# Altium schematic sheet Regulators.SchDoc
size A4
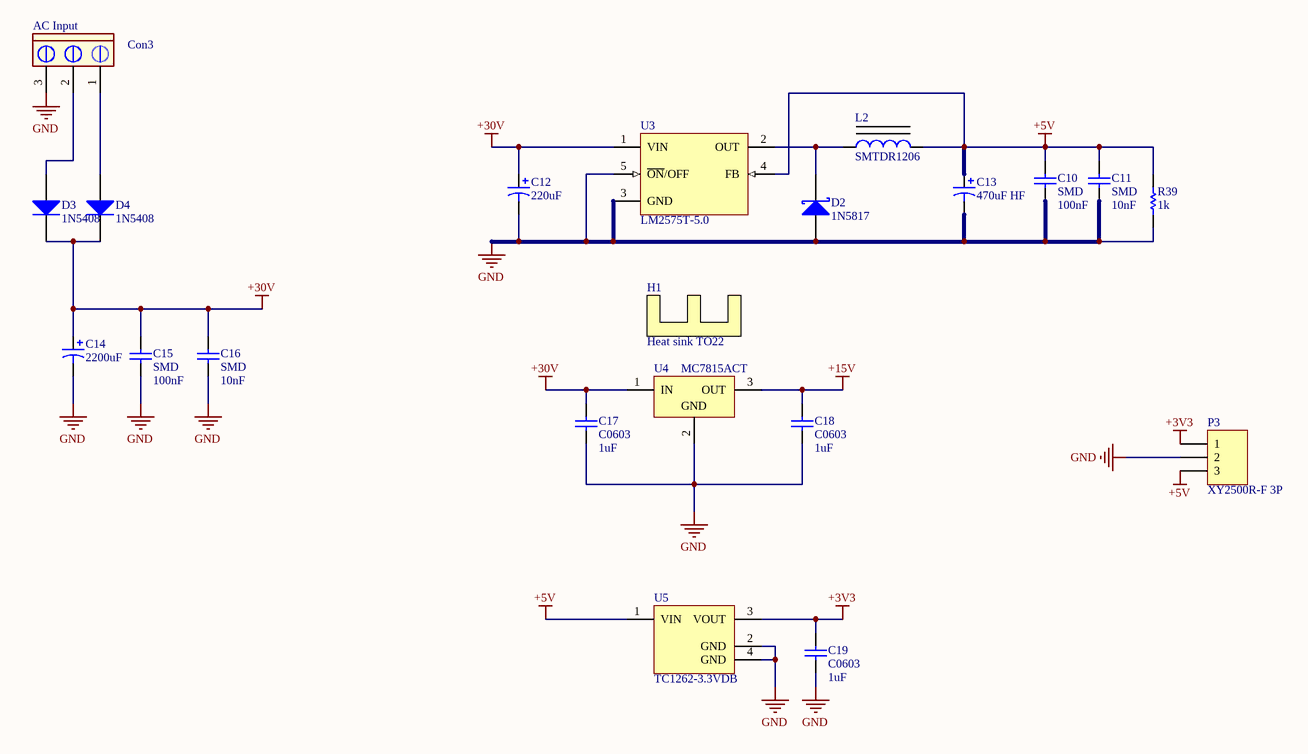
[diagram p0: Regulators.SchDoc]

## Parts
C10  SMD  value 100nF  [1206]
C11  SMD  value 10nF  [1206]
C12  220uF  [CAPPR5-10X16]
C13  470uF HF  [CAPPR5-10X20]
C14  2200uF  [CAPPR7.5-16X35.5]
C15  SMD  value 100nF  [1206]
C16  SMD  value 10nF  [1206]
C17  C0603  value 1uF  [0603]
C18  C0603  value 1uF  [0603]
C19  C0603  value 1uF  [0603]
Con3  AC Input  [My_CN3]
D2  1N5817  [DO-41]
D3  1N5408  [DO-201AD]
D4  1N5408  [DO-201AD]
H1  Heat sink TO22  [My_Heat_sink_TO22]
L2  SMTDR1206  [SMTDR1206 Inductor]
P3  XY2500R-F 3P  [XY2500R-F 3P]
R39  value 1k  [8RB-1206]  (hidden comment: SMD)
U3  LM2575T-5.0  [T05A]
U4  MC7815ACT  [221A-04]
U5  TC1262-3.3VDB  [SOT-223-DB3_N]

## Nets
+3V3: C19.2 P3.1 U5.3(VOUT)
+5V: C10.2 C11.2 C13.1 L2.2 P3.3 R39.2 U3.4(FB) U5.1(VIN)
+15V: C18.2 U4.3(OUT)
+30V: C12.1 C14.1 C15.2 C16.2 C17.2 D3.2(K) D4.2(K) U3.1(VIN) U4.1(IN)
GND: C10.1 C11.1 C12.2 C13.2 C14.2 C15.1 C16.1 C17.1 C18.1 C19.1 Con3.3 D2.1(A) P3.2 R39.1 U3.3(GND) U3.5(~{ON}/OFF) U4.2(GND) U5.2(GND) U5.4(GND)
NetCon3_1: Con3.1 D4.1(A)
NetCon3_2: Con3.2 D3.1(A)
NetD2_2: D2.2(K) L2.1 U3.2(OUT)

## Library data of the parts
C10 C11 C15 C16 = C1206: Ceramic Chip Capacitor - Standard; Published: 17-Jul-2002; LatestRevisionDate: 19-Mar-2004; LatestRevisionNote: Silkscreen size reduced.; DatasheetDocument: Mar-2001; PackageDocument: Mar-2001; PackageReference: 1206; Publisher: Altium Limited; Code_JEITA: 1206; Code_IPC: 3216 [1206]; ComponentLink1Description: Manufacturer Link; ComponentLink1URL: http://www.kemet.com/; ComponentLink2Description: Datasheet; ComponentLink2URL: http://www.kemet.com/kemet/web/homepage/kechome.nsf/vapubfilesname/F3102TA.pdf/$file/F3102TA.pdf
C12 = EKA00DD322J00: Aluminum Electrolytic Capacitor, Radial Style with Long Leads: 220uF, 63V; Note: Refer to Manufacturer's Data Sheets for other lead formations; DrillSize: Nominal, Rounded To The Nearest 0.1mm; Published: 19-Mar-2004; DatasheetDocument: 20-Feb-2001; PackageReference: CAPPR5-10X16; Publisher: Altium Limited; ComponentLink1Description: Manufacturer Link; ComponentLink1URL: http://www.vishay.com/; ComponentLink2Description: Datasheet; ComponentLink2URL: http://www.vishay.com/docs/25014/eka.pdf; Value: 220uF
C13 = EKC00DE347E00: Aluminum Electrolytic Capacitor, Radial Style with Long Leads: 470uF, 25V; Note: Refer to Manufacturer's Data Sheets for other lead formations; DrillSize: Nominal, Rounded To The Nearest 0.1mm; Published: 19-Mar-2004; DatasheetDocument: 12-Jan-2000; PackageReference: CAPPR5-10X20; Publisher: Altium Limited; ComponentLink1Description: Manufacturer Link; ComponentLink1URL: http://www.vishay.com/; ComponentLink2Description: Datasheet; ComponentLink2URL: http://www.vishay.com/docs/25009/ekc.pdf; Value: 470uF
C14 = EKA00JL422H00: Aluminum Electrolytic Capacitor, Radial Style with Long Leads: 2200uF, 50V; Note: Refer to Manufacturer's Data Sheets for other lead formations; DrillSize: Nominal, Rounded To The Nearest 0.1mm; Published: 19-Mar-2004; DatasheetDocument: 20-Feb-2001; PackageReference: CAPPR7.5-16X35.5; Publisher: Altium Limited; ComponentLink1Description: Manufacturer Link; ComponentLink1URL: http://www.vishay.com/; ComponentLink2Description: Datasheet; ComponentLink2URL: http://www.vishay.com/docs/25014/eka.pdf; Value: 2200uF
C17-C19 = C0603: C1608X7R1C105K X7R; Note: Footprint corresponds to dimensions for bulk cassette packaging. This case size has tightened tolerances.; Published: 17-Jul-2002; LatestRevisionDate: 19-Mar-2004; LatestRevisionNote: Silkscreen size reduced.; DatasheetDocument: Mar-2001; PackageDocument: Mar-2001; PackageReference: 0603; Publisher: Altium Limited; Code_JEITA: 0603; Code_IPC: 1608 [0603]; ComponentLink1Description: Manufacturer Link; ComponentLink1URL: http://www.kemet.com/; ComponentLink2Description: Datasheet; ComponentLink2URL: http://www.kemet.com/kemet/web/homepage/kechome.nsf/vapubfilesname/F3102TA.pdf/$file/F3102TA.pdf
Con3 = CON3 pin Green: Connector green screw
D2 = 1N6095: Schottky Rectifier; Note: No PCB Footprint Available; Published: 8-Jun-2000; LatestRevisionDate: 17-Jul-2002; LatestRevisionNote: Re-released for DXP Platform.; DatasheetVersion: Dec-1997; PackageReference: DO-203AA; Publisher: Altium Limited; ComponentLink1Description: Manufacturer Link; ComponentLink1URL: http://www.irf.com/; ComponentLink2Description: Datasheet; ComponentLink2URL: http://www.irf.com/product-info/datasheets/data/1n6096.pdf
D3 D4 = Diode 1N5408: 3 Amp Medium Power Silicon Rectifier Diode; Published: 8-Jun-2000; LatestRevisionDate: 17-Jul-2002; LatestRevisionNote: Re-released for DXP Platform.; DatasheetVersion: Aug-1984; PackageReference: DO-201AD; Publisher: Altium Limited; PackageDescription: Diode, Axial; Body 9.5 x 5.3 mm (LxDia. max), Lead Dia. 1.32 mm (max); ComponentLink1Description: Manufacturer Link; ComponentLink1URL: http://www.irf.com/
H1 = Heat sink TO22: Heat sink for TO22
L2 = 100UHY SMD 18.54X7.11MM 20% 3A 0.19E SMTDR1206-101M: Value: 100uH
P3 = XY2500R-F 3P: HEADER 3P P/CI 90gra VERDE P=3.81MM XY2500R-F
R39 = ERJ8BQ: Low Ohmic Value Thick Film Chip Resistor, 0.22 Ohm to 9.1 Ohm Range, 1%, 2% and 5% Tolerance, 1206 Size, 0.33 W; Published: 17-Dec-2003; LatestRevisionDate: 19-Mar-2004; LatestRevisionNote: Silkscreen size reduced.; PackageDocument: Mar-2003; PackageReference: 8RB-1206; Publisher: Altium Limited; Code_IPC: 3216 [1206]; ComponentLink1Description: Manufacturer Link; ComponentLink1URL: http://www.panasonic.com/industrial/components/resistive_products.htm; ComponentLink2Description: Datasheet; ComponentLink2URL: http://www.panasonic.com/industrial/components/pdf/AOA0000CE3.pdf
U3 = LM2575T-5.0: SIMPLE SWITCHER® 1A Step-Down Voltage Regulator, 5-pin TO-220; Manufacturer: National Semiconductor; PackageTopMarking: NSUZXYTTE#*LM2575T*-5.0 P+; PowerWise: N; Published: 4-Dec-2008; DatasheetVersion: Apr-2007; PackageVersion: revJ, Jan-1992; PackageReference: T05A; Publisher: Altium Limited; PackageDescription: TO-220, Molded, 5 Lead, Straight; Supplier 1: Farnell; Supplier Part Number 1: 1523839; Supplier 2: Farnell; Supplier Part Number 2: 9488090; PartNumber: LM2575T-5.0; RoHS: N; PinCount: 5; CompType: Switcher; Code_JEDEC: TO-220-AB; ComponentLink1Description: LM2575 Datasheet; ComponentLink1URL: http://www.national.com/ds/LM/LM2575.pdf; ComponentLink2Description: LM2575 Web Page; ComponentLink2URL: http://www.national.com/pf/LM/LM2575.html; ComponentLink3Description: T05A Package Page; ComponentLink3URL: http://www.national.com/packaging/folders/t05a.html
U4 = MC7815ACT: 3-Terminal Positive Fixed Voltage Regulator; Note: Pin 2 is electrically connected to TAB; Published: 17-Jul-2002; DatasheetVersion: 1988; PackageReference: 221A-04; Publisher: Altium Limited; PackageDescription: TO, Thru-Hole, Vertical, Heatsink Mounted; 3 In-Line Leads; Pitch 2.54 mm; Code_JEDEC: TO-262-AA; ComponentLink1Description: Manufacturer Link; ComponentLink1URL: http://www.onsemi.com/site/products/taxonomy/0,4438,503,00.html; ComponentLink2Description: Datasheet; ComponentLink2URL: http://www.onsemi.com/pub/Collateral/MC7800-D.PDF
U5 = TC1262-3.3VDB: 500mA Fixed Output CMOS LDO, 3-Pin SOT-223, Extended Temperature; Published: 29-Jan-2009; DatasheetVersion: revB, 2002; PackageVersion: revBB, Aug-2009; PackageReference: SOT-223-DB3; Publisher: Altium Limited; PackageDescription: 3-Lead Plastic Small Outline Transistor (DB) [SOT-223]; Supplier 1: Digi-Key; Supplier Part Number 1: TC1262-3.3VDB-ND; ComponentLink1Description: Datasheet; ComponentLink1URL: http://ww1.microchip.com/downloads/en/DeviceDoc/21373b.pdf; ComponentLink2Description: Packaging Specification; ComponentLink2URL: http://www.microchip.com/stellent/groups/techpub_sg/documents/packagingspec/en012702.pdf; ComponentLink3Description: Microchip.com Home; ComponentLink3URL: http://www.microchip.com/